# EasyEDA Pro project ProPrj_nrf52833_LighthouseTag_2025-07-26.epro, board PCB18_2
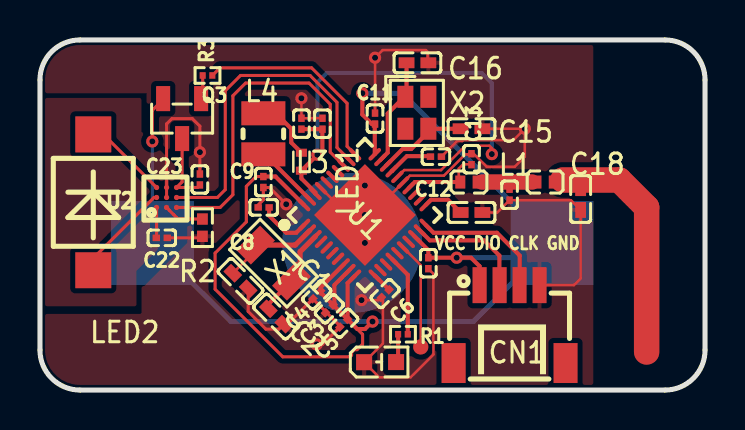
[diagram p9: board, top side]
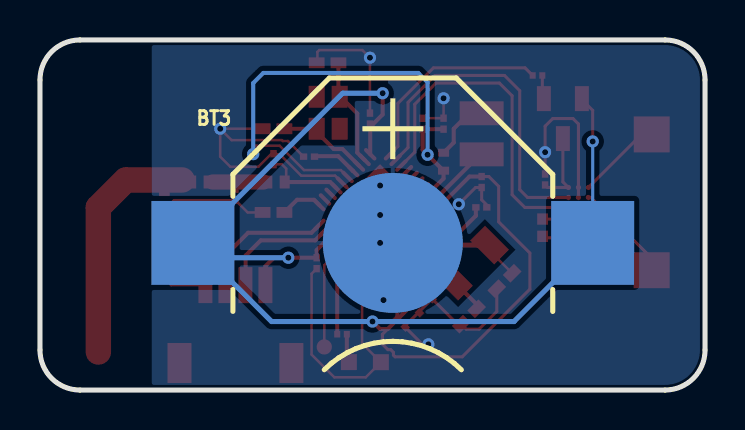
[diagram p10: board, bottom side, seen from below]

Outline 33.27 x 17.53 mm; copper layers: Top Layer, Bottom Layer. Coordinates in mm from the lower left corner of the outline.
Outline path: 0,15.53 0,2 arc(0.59,0.59) 2,0 31.27,0 arc(32.69,0.59) 33.27,2 33.27,15.53 arc(32.69,16.94) 31.27,17.53 2,17.53 arc(0.59,16.94) 0,15.53
Stack: Top Layer 0.035mm / Dielectric1 1.51mm FR4 er 4.5 / Bottom Layer 0.035mm

## Design rules (mm)
template: 用户自定义配置
spacing safeClearance (default): track to track 0.152, other pairs 0.152 to 0.3
track width trackWidth (default): min 0.127, default 0.203, max 1.27
differential pair differentialPair (default): width min 0.127, default 0.254, max 2.54; gap min 0.152, default 0.152
via viaSize (default): diameter min 0.5, default 0.61, max 10; hole min 0.3, default 0.305, max 5.999

## Placement (name value [footprint] x y rotation side)
BT3  MY-1632-03  [BAT-SMD_MY-1632-03]  15.62 7.37 180 bottom
C1  12pF  [C0402]  10.03 5.46 135 top
C2  12pF  [C0402]  11.81 3.68 135 top
C3  4.7uF  [C0201]  14.48 4.06 225 top
C4  4.7uF  [C0201]  13.85 4.76 225 top
C5  4.7uF  [C0201]  15.2 3.35 225 top
C6  4.7uF  [C0201]  17.27 4.83 225 top
C7  100nF  [C0201]  19.43 6.35 90 top
C8  100nF  [C0201]  11.19 9.14 180 top
C9  1uF  [C0201]  11.18 10.41 270 top
C10  820pF  [C0402]  21.59 8.89 0 top
C11  100nF  [C0201]  16.76 13.59 90 top
C12  100nF  [C0201]  19.81 11.68 0 top
C13  1pF  [C0201]  21.59 11.56 90 top
C14  1.2pF  [C0201]  23.5 9.78 90 top
C15  12pF  [C0402]  21.59 13.08 0 top
C16  12pF  [C0402]  18.89 16.38 0 top
C18  12pF  [C0402]  27.05 9.56 90 top
C20  47nF  [C0201]  13.08 13.33 270 top
C21  1uF  [C0201]  14.13 13.33 270 top
C22  1uF  [C0201]  6.1 7.62 0 top
C23  100nF  [C0201]  8 10.54 90 top
CN1  1.0-4PWB  [CONN-SMD_4P-P1.00_DEALON_1.0-4PWB]  23.5 3.3 0 top
L1  4.7nH  [IND-SMD_L1.0-W0.6]  21.46 10.41 0 top
L2  2.2nH  [IND-SMD_L1.0-W0.6]  25.27 10.41 0 top
L3  15nH  [IND-SMD_L1.0-W0.5-2]  13.08 11.43 270 top
L4  10uH  [IND-SMD_L2.5-W2.0]  11.18 12.83 90 top
LED1  NCD0603G1  [LED0603-RD_1]  17.02 1.4 0 top
LED2  VBPW34S  [SENSOR-SMD_L4.4-W3.9]  2.67 9.4 90 top
NOREF  -  [Pad_e1170]  19.05 2.16 0 top
Q3  HL3407A  [SOT-23-3_L2.9-W1.3-P1.90-LS2.4-BL-1]  7.11 13.59 180 top
R1  10kΩ  [R0201]  18.16 2.79 180 top
R2  15kΩ  [R0402]  8.13 8.13 90 top
R3  1kΩ  [R0201]  8.38 15.75 180 top
U1  nRF52833-QDAA-R  [QFN-40_L5.0-W5.0-P0.40-TL-EP3.6]  16.26 8.76 45 top
U2  -  [TS4231]  6.34 9.65 90 top
X1  32.768kHz  [OSC-SMD_L3.2-W1.5]  11.68 6.36 135 top
X2  32MHz  [CRYSTAL-SMD_4P-L2.0-W1.6-BL-2]  18.86 13.88 270 top

## Footprints (pads in the part's own frame, mm; a bottom-side part is the same pattern mirrored in y, then rotated)
BAT-SMD_MY-1632-03
  rect 4.15x4.2 smd: 1(-10,0) 1(10,0)
  round 7 smd: 2(0,0)
C0201
  rect 0.368x0.324 smd: 1(-0.275,0) 2(0.275,0)
C0402
  rect 0.79x0.54 smd: 1(-0.545,0) 2(0.545,0)
CONN-SMD_4P-P1.00_DEALON_1.0-4PWB
  rect 0.7x1.8 smd: 1(-1.5,1.95) 2(-0.5,1.95) 3(0.5,1.95) 4(1.5,1.95)
  rect 1.2x2 smd: 5(2.8,-1.95) 6(-2.8,-1.95)
CRYSTAL-SMD_4P-L2.0-W1.6-BL-2
  rect 1.1x0.8 smd: 1(-0.8,-0.575) 2(0.8,-0.575) 3(0.8,0.575) 4(-0.8,0.575)
IND-SMD_L1.0-W0.5-2
  rect 0.4x0.55 smd: 1(-0.45,0) 2(0.45,0)
IND-SMD_L1.0-W0.6
  rect 0.5x0.648 smd: 1(-0.434,0) 2(0.434,0)
IND-SMD_L2.5-W2.0
  rect 1.2x2.2 smd: 1(1.028,0) 2(-1.028,0)
LED0603-RD_1
  rect 0.8x0.8 smd: 1(-0.799,-0.004) 2(0.799,0.004)
OSC-SMD_L3.2-W1.5
  rect 1.05x1.7 smd: 1(-1.275,0) 2(1.275,0)
Pad_e1170
  round 0.762 smd: 1(0,0)
QFN-40_L5.0-W5.0-P0.40-TL-EP3.6
  oval 0.8x0.2 smd: 1(-2.499,1.8) 2(-2.499,1.4) 3(-2.499,1) 4(-2.499,0.6) 5(-2.499,0.2) 6(-2.499,-0.2) 7(-2.499,-0.6) 8(-2.499,-1) 9(-2.499,-1.4) 10(-2.499,-1.8) 21(2.499,-1.8) 22(2.499,-1.4) 23(2.499,-1) 24(2.499,-0.6) 25(2.499,-0.2) 26(2.499,0.2) 27(2.499,0.6) 28(2.499,1) 29(2.499,1.4) 30(2.499,1.8)
  oval 0.2x0.8 smd: 11(-1.8,-2.499) 12(-1.4,-2.499) 13(-1,-2.499) 14(-0.6,-2.499) 15(-0.2,-2.499) 16(0.2,-2.499) 17(0.6,-2.499) 18(1,-2.499) 19(1.4,-2.499) 20(1.8,-2.499) 31(1.8,2.499) 32(1.4,2.499) 33(1,2.499) 34(0.6,2.499) 35(0.2,2.499) 36(-0.2,2.499) 37(-0.6,2.499) 38(-1,2.499) 39(-1.4,2.499) 40(-1.8,2.499)
  rect 3.6x3.6 smd: 41(0,0)
R0201
  rect 0.303x0.324 smd: 1(-0.241,0) 2(0.241,0)
R0402
  rect 0.566x0.54 smd: 1(-0.433,0) 2(0.433,0)
SENSOR-SMD_L4.4-W3.9
  rect 1.8x1.8 smd: 1(-3.4,0) 2(3.4,0)
SOT-23-3_L2.9-W1.3-P1.90-LS2.4-BL-1
  rect 0.7x1.25 smd: 1(-0.95,-1) 2(0.95,-1) 3(0,1)
TS4231
  round 0.262 smd: 1(-0.508,0.508) 2(-0.008,0.508) 3(0.492,0.508) 4(-0.508,0.008) 5(-0.008,0.008) 6(0.492,0.008) 7(-0.508,-0.492) 8(-0.008,-0.492) 9(0.492,-0.492)

## Nets
As in the schematic, except:
RESET: NOREF.1 U1.16

Pads without a net: CN1 5 6; U1 4 5 6 7 12 13 15 17 22 23 34 35 36; X2 2 4

## Via types
v1: diameter 0.61, hole 0.305, Top Layer to Bottom Layer, 16 vias

## Routing (per net, layer and track width the routed paths; a pad name or vN(x,y) marks a point on that pad's centre or on a via; arc(x,y) is an arc through that point)
GND: length 74.6
  Top Layer w0.127: C10.2 22.88,8.89 C14.1 26.56,9.5 C18.1 27.05,5.59 26.72,5.25 CN1.4 ; v1(13.08,14.61) C20.1 14.13,13.61 C21.1 ; v1(24.26,13.08) C15.2 ; v1(24.26,13.08) 23.69,12.51 21.17,12.51 21.13,12.47 20.87,12.47 C12.2 ; v1(24.26,13.08) 24.26,11.68 23.75,11.18 22.35,11.18 21.7,11.83 C13.2 21.46,11.83 21.43,11.8 21.27,11.8 20.21,10.73 18.51,10.73 U1.25 16.54,8.76 v1(16.26,8.76) 15.41,8.76 U1.37 ; C16.2 19.39,16.42 19.39,16.93 19.3,17.02 17.15,17.02 v1(16.76,16.64) C11.2 ; v1(16.09,4.5) 16.95,4.5 17.08,4.63 17.16,4.55 17.16,2.33 LED1.1 16.98,0.64 18.54,0.64 19.69,1.78 19.69,5.82 C7.1
  Top Layer w0.152: v1(12.32,9.3) 11.48,10.14 C9.2 11.18,9.52 10.86,9.2 C8.2 ; C1.1 10.42,3.93 11.3,3.05 11.95,3.05 C2.1 12.38,3.3 C4.2 15,3.22 C5.2 14.14,2.29 v1(13.84,2.29) ; C22.2 8.05,7.62 R2.1 ; U2.5 U2.6 6.33,13.32 6.6,13.59 7.62,13.59 8,13.21 v1(8,11.91) C23.2
  vias: v1(16.26,10.24) v1(16.26,7.37)
VDD_NRF: length 85.1
  Top Layer w0.152: Q3.2 6.16,14.54 5.62,14 v1(5.62,12.45) ; 15.88,3.05 16.14,2.79 16.14,2.3 15.87,2.02 15.72,2.02 15.59,1.89 15.59,1.75 15.51,1.66 12.15,1.66 8.76,5.05 8.76,6.86 10.32,8.42 10.32,10.2 10.82,10.69 C9.1
  Top Layer w0.203: C5.1 14.67,4.26 ; C5.1 15.39,5.35 15.76,5.72 ; C5.1 15.88,3.05 16.26,3.05 v1(16.64,3.43) ; 14.67,4.26 14.04,4.89 C4.1 14.04,5.13 U1.8 ; 14.67,4.26 14.73,4.32 14.73,5.26 U1.9 ; 18.73,7.7 19.43,7 C7.2 v1(20.85,6.62) 21.57,6.62 22,6.2 CN1.1 ; U1.30 16.75,13.3 C11.1 16.61,13.31 16.13,13.79 v1(16.13,14.86) ; U1.40 11.78,10.69 C9.1
  Bottom Layer w0.152: BT3.1 v1(5.62,12.45)
  Bottom Layer w0.254: v1(16.13,14.86) 18.13,14.86 BT3.1 24.88,6.62 ; v1(20.85,6.62) 24.88,6.62 ; 24.88,6.62 21.68,3.43 v1(16.64,3.43) 9.56,3.43 BT3.1
D/CFGDATA: length 17
  Top Layer w0.152: U2.7 9.01,9.14 9.65,9.78 9.65,14.73 10.29,15.37 13.46,15.37 14.52,14.31 14.52,11.91 U1.33
DCC: length 3.1
  Top Layer w0.203: 11.18,11.42 11.62,11.42 U1.39
DEC4: length 27
  Top Layer w0.127: v1(22.61,11.81) 22.61,12.1 22.48,12.23 21.29,12.23 20.06,11.01 18.22,11.01 17.88,10.67
  Top Layer w0.203: 14.13,13.06 C21.2 ; 14.13,13.06 14.13,12.03 v1(13.88,11.78) L3.2 13.08,10.59 13.78,9.89 U1.38 ; 14.13,13.06 C20.2
  Bottom Layer w0.203: v1(22.61,11.81) 22.61,15.37 22.1,15.88 14.35,15.88 13.88,15.4 v1(13.88,11.78)
E/CFGCLK: length 17.2
  Top Layer w0.152: U1.32 14.86,12.14 14.86,14.4 13.51,15.75 10.03,15.75 9.27,14.99 9.27,10.03 8.88,9.64 U2.8
LED: length 4.1
  Top Layer w0.203: U1.14 18.4,5.77 R1.1
POWER_TS4231: length 10.3
  Top Layer w0.152: U1.31 15.37,12.2 15.37,14.35 13.59,16.13 9,16.13 R3.1
RESET: length 5.4
  Top Layer w0.127: 18.92,2.16 19.05,2.29 19.05,6.25 18.16,7.14
SWDCLK: length 6.8
  Top Layer w0.203: 19.3,8.27 19.69,7.87 22.86,7.87 24,6.73 24,5.26 CN1.3
SWDIO: length 6
  Top Layer w0.203: CN1.2 22.99,5.26 22.99,6.73 22.22,7.49 19.51,7.49 U1.19
XC1: length 4.6
  Top Layer w0.203: C15.1 X2.3 19.5,13.01 19.5,12.99 18.57,12.06 18.14,12.06 17.32,11.24
XC2: length 5.4
  Top Layer w0.203: C16.1 18.34,14.74 X2.1 18.24,14.68 17.4,13.84 17.4,11.89 U1.29
XL1: length 4.9
  Top Layer w0.127: C1.2 10.78,6.98 X1.2
  Top Layer w0.254: X1.2 12.77,7.26 U1.2
XL2: length 4.6
  Top Layer w0.203: X1.1 11.43,4.29 C2.2
  Top Layer w0.254: X1.1 13.01,5.88 13.01,6.93 13.79,7.7
$1N2289: length 2.1
  Top Layer w0.203: C10.1 20.41,9.53 19.56,9.53 19.3,9.26
$1N2530: length 3.9
  Top Layer w0.127: C13.1 21.57,11.3 21.17,11.3 20.96,11.08 20.96,10.67
  Top Layer w0.203: U1.24 18.76,10.41 L1.1
$1N2985: length 2.5
  Top Layer w0.762: 22.1,10.41 24.64,10.41
$1N3242: length 12
  Top Layer w1.27: 26.16,10.52 28.98,10.52 30.35,9.14 30.35,1.91
$1N3495: length 2.2
  Top Layer w0.203: 19.51,11.71 18.36,11.71 17.63,10.99 arc(17.62,10.97) 17.61,10.96 U1.27
$1N6091: length 3
  Top Layer w0.203: 11.18,13.47 12.18,13.47 12.57,13.08 12.57,12.39 L3.1
$1N9430: length 1.5
  Top Layer w0.152: U2.1 5.83,7.63 C22.1
$1N11204: length 4.3
  Top Layer w0.152: LED2.2 3.18,12.8 U2.3
$1N11226: length 5
  Top Layer w0.152: LED2.1 2.67,6.6 5.71,9.64 U2.2
$1N11357: length 2
  Top Layer w0.152: 8.13,8.56 6.91,8.56 6.69,8.78 6.69,8.78 6.47,8.99 6.47,9 U2.4
$1N22902: length 1.2
  Top Layer w0.203: R1.2 17.92,1.58 17.9,1.56
$1N23087: length 2.7
  Top Layer w0.203: C8.1 11.47,8.73 12.32,7.87 12.82,7.87 U1.1
$1N28962: length 3.8
  Top Layer w0.152: Q3.3 7.11,10.42 U2.9 7.88,10.14 C23.1
$1N29852: length 1
  Top Layer w0.203: 16.75,5.72 16.76,5.72 C6.1
$1N31595: length 1.2
  Top Layer w0.152: 8.06,14.59 8.14,14.67 R3.2

## Copper pours and planes (outline as drawn; the poured copper is in the pictures)
GND on Top Layer: 5.33,14.86 5.33,13.08 7.37,11.05 7.37,7.37 5.21,5.21 5.08,5.21 5.08,3.87 5.02,3.81 -0.47,3.81 -0.47,-0.29 -0.25,-0.51 27.75,-0.51 27.75,18.73 27.69,18.8 1.27,18.8 -1.52,16 -1.52,14.77 0.09,14.77 0.19,14.86
GND on Top Layer: 0,14.62 5.06,14.62 5.08,14.61 5.08,12.94 7.36,10.66 7.36,8.51 4.83,5.97 4.83,4.19 0.04,4.19 0.04,14.56 0,14.61
GND on Bottom Layer: -3.56,18.54 36.19,18.54 36.19,-2.54 -3.56,-2.54

## Text on the board
Top Silkscreen Layer: VCC DIO CLK GND
